# EAGLE schematic board1_32u4 (EAGLE 8.6.1)
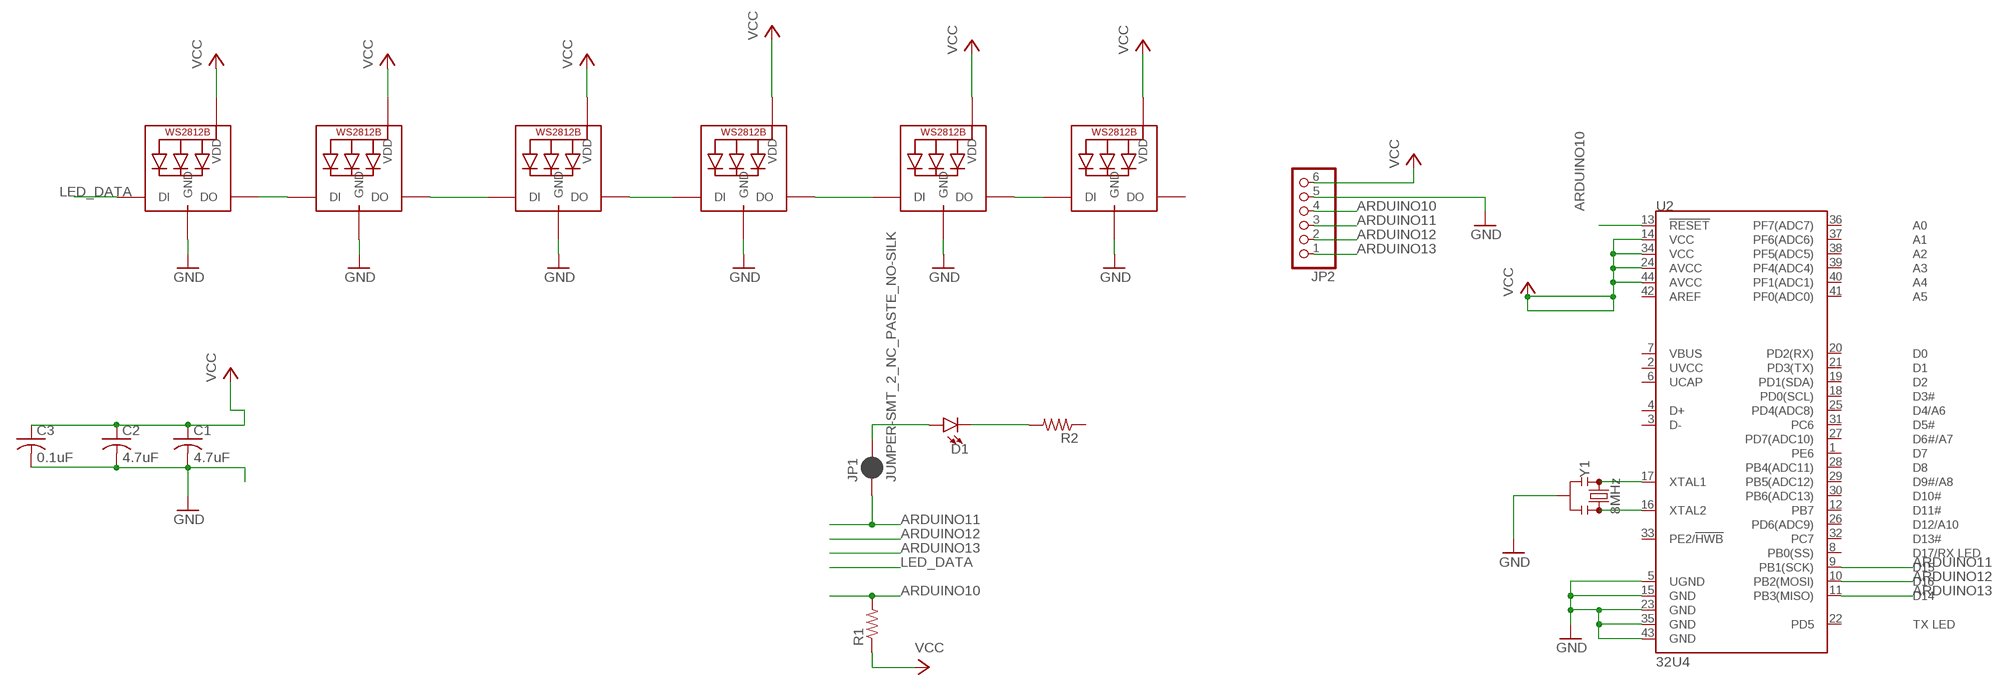
[diagram p0: schematic, sheet 1]

## Parts
C1  4.7uF  C-USC0603  [C0603]
C2  4.7uF  C-USC0603  [C0603]
C3  0.1uF  C-USC0603  [C0603]
D1  LED0603  [LED-0603]
JP1  JUMPER-SMT_2_NC_PASTE_NO-SILK  [SMT-JUMPER_2_NC_PASTE_NO-SILK]
JP2  PINHD-1X6  [1X06]
LED1  WS2812B5050  [WS2812B]
LED2  WS2812B5050  [WS2812B]
LED3  WS2812B5050  [WS2812B]
LED4  WS2812B5050  [WS2812B]
LED5  WS2812B5050  [WS2812B]
LED6  WS2812B5050  [WS2812B]
R1  R-US_R0603  [R0603]
R2  R-US_R0603  [R0603]
U2  32U4  ATMEGA32U4TQFP-44  [TQFP44]
Y1  8MHz  RESONATOR-8MHZSMD_3.2X1.3  [RESONATOR-SMD-3.2X1.3]

## Nets
ARDUINO10: JP2.4 R1.2 U2.13(!RESET)
ARDUINO11: JP1.1 JP2.3 U2.9(PB1(SCK))
ARDUINO12: JP2.2 U2.10(PB2(MOSI))
ARDUINO13: JP2.1 U2.11(PB3(MISO))
GND: C1.2 C2.2 C3.2 JP2.5 LED1.3-GND(GND) LED2.3-GND(GND) LED3.3-GND(GND) LED4.3-GND(GND) LED5.3-GND(GND) LED6.3-GND(GND) U2.5(UGND) U2.15(GND) U2.23(GND) U2.35(GND) U2.43(GND) Y1.2
LED_DATA: LED1.4-DIN(DI)
N$1: Y1.1
N$2: LED1.2-DOUT(DO) LED2.4-DIN(DI)
N$3: Y1.3
N$4: D1.C R2.2
N$8: D1.A JP1.2
N$9: LED2.2-DOUT(DO) LED3.4-DIN(DI)
N$10: LED3.2-DOUT(DO) LED4.4-DIN(DI)
N$11: LED4.2-DOUT(DO) LED5.4-DIN(DI)
N$12: LED5.2-DOUT(DO) LED6.4-DIN(DI)
VCC: C1.1 C2.1 C3.1 JP2.6 LED1.1-VDD(VDD) LED2.1-VDD(VDD) LED3.1-VDD(VDD) LED4.1-VDD(VDD) LED5.1-VDD(VDD) LED6.1-VDD(VDD) R1.1 U2.14(VCC) U2.24(AVCC) U2.34(VCC) U2.44(AVCC)
Unconnected: LED6.2-DOUT(DO) R2.1 U2.1(PE6) U2.2(UVCC) U2.3(D-) U2.4(D+) U2.6(UCAP) U2.7(VBUS) U2.8(PB0(SS)) U2.12(PB7) U2.16(XTAL2) U2.17(XTAL1) U2.18(PD0(SCL)) U2.19(PD1(SDA)) U2.20(PD2(RX)) U2.21(PD3(TX)) U2.22(PD5) U2.25(PD4(ADC8)) U2.26(PD6(ADC9)) U2.27(PD7(ADC10)) U2.28(PB4(ADC11)) U2.29(PB5(ADC12)) U2.30(PB6(ADC13)) U2.31(PC6) U2.32(PC7) U2.33(PE2/!HWB) U2.36(PF7(ADC7)) U2.37(PF6(ADC6)) U2.38(PF5(ADC5)) U2.39(PF4(ADC4)) U2.40(PF1(ADC1)) U2.41(PF0(ADC0)) U2.42(AREF)

## Library data of the parts
C1-C3 = adafruit:C-US: CAPACITOR, American symbol
D1 = SparkFun-LED:LED: LED (Generic) Standard schematic elements and footprints for 5mm, 3mm, 1206, and 0603 sized LEDs. Generic LEDs with no color specified.
JP1 = SparkFun-Jumpers:JUMPER-SMT_2_NC_PASTE: Normally closed solder jumper This jumper has an aperture in the stencil to allow solder paste to bridge the split in the wire so it's normally closed (NC). Wick off the solder to open the connection. Reapply solder to reclose the connection.
JP2 = pinhead:PINHD-1X6: PIN HEADER
LED1-LED6 = adafruit:WS2812B
R1 R2 = adafruit:R-US_: RESISTOR, American symbol
U2 = SparkFun-IC-Microcontroller:ATMEGA32U4: Atmel MCU, 32KByte Atmel 44-pin 8-bit Microcontroller with 32KBytes of ISP Flash and USB Controller Datasheet <http://cdn.sparkfun.com/datasheets/Dev/Arduino/Boards/ATMega32U4.pdf> SparkFun Products LilyPad Arduino USB - ATmega32U4 Board <https://www.sparkfun.com/products/12049> (DEV-12049) Pro Micro - 5V/16MHz <https://www.sparkfun.com/products/12640> (DEV-12640) Pro Micro - 3.3V/8MHz <https://www.sparkfun.com/products/12587> (DEV-12587) Fio v3 - ATmega32U4 <https://www.sparkfun.com/products/11520> (DEV-11520) Qduino Mini <https://www.sparkfun.com/products/13614> (DEV-13614) Makey Makey - Standard Kit <https://www.sparkfun.com/products/11511> (WIG-11511) Makey Makey Deluxe Kit <https://www.sparkfun.com/products/11519> (WIG-11519); PROD_ID: IC-11161
Y1 = SparkFun-Clocks:RESONATOR-8MHZ: 8MHz Resonator Digikey Example <http://www.digikey.com/product-detail/en/murata-electronics-north-america/CSTCE10M0G55-R0/490-1196-1-ND/584633> Frequency: 8MHz Frequency Stability: ±0.2% Frequency Tolerance: ±0.5% Capacitance: 33pF SparkFun Products Arduino Pro Mini 328- 3.3V/8MHz <https://www.sparkfun.com/products/11114> SparkFun Digital Sandbox <https://www.sparkfun.com/products/12651>; PROD_ID: XTAL-08895